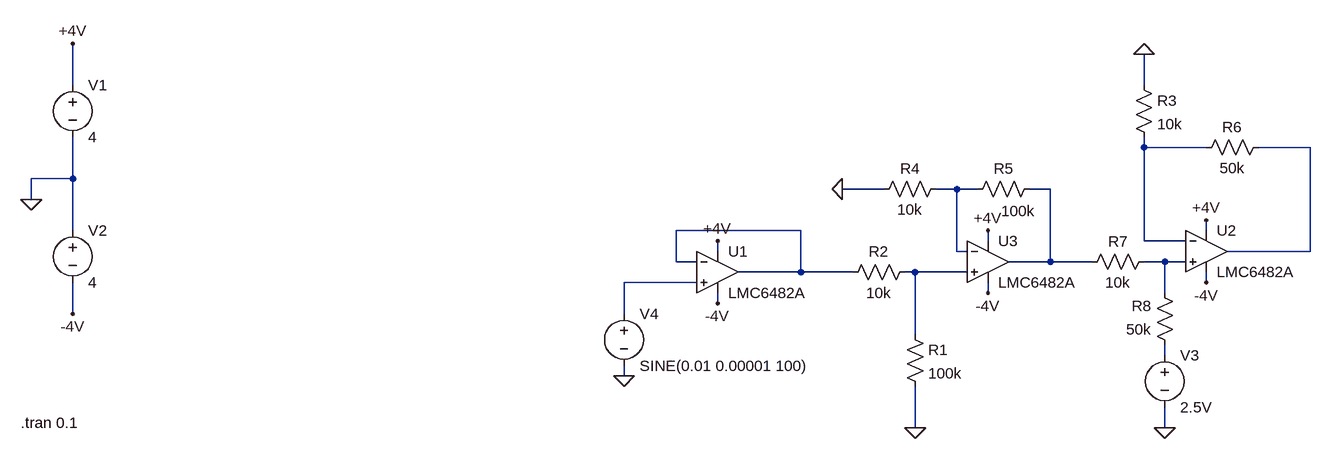
[diagram p0: schematic Lettore_fem.asc]
Lettore_fem.asc, the LTspice schematic file:
Version 4
SHEET 1 1044 680
WIRE -864 -64 -864 -128
WIRE 784 -64 784 -112
WIRE 784 32 784 16
WIRE 880 32 784 32
WIRE 1040 32 960 32
WIRE -864 80 -864 16
WIRE -864 80 -928 80
WIRE 384 96 320 96
WIRE 496 96 464 96
WIRE 528 96 496 96
WIRE 640 96 608 96
WIRE -928 112 -928 80
WIRE -864 160 -864 80
WIRE 256 160 64 160
WIRE 880 160 880 144
WIRE 544 176 544 160
WIRE 784 176 784 32
WIRE 848 176 784 176
WIRE 128 192 128 176
WIRE 496 192 496 96
WIRE 512 192 496 192
WIRE 1040 192 1040 32
WIRE 1040 192 912 192
WIRE 64 208 64 160
WIRE 96 208 64 208
WIRE 640 208 640 96
WIRE 640 208 576 208
WIRE 704 208 640 208
WIRE 816 208 784 208
WIRE 848 208 816 208
WIRE 256 224 256 160
WIRE 256 224 160 224
WIRE 336 224 256 224
WIRE 432 224 416 224
WIRE 512 224 432 224
WIRE 96 240 -16 240
WIRE 880 240 880 224
WIRE 544 256 544 240
WIRE 816 256 816 208
WIRE 128 272 128 256
WIRE -864 288 -864 240
WIRE -16 288 -16 240
WIRE 432 320 432 224
WIRE 816 352 816 336
WIRE -16 384 -16 368
WIRE 432 464 432 400
WIRE 816 464 816 432
FLAG -928 112 0
FLAG -864 -128 +4V
FLAG -864 288 -4V
FLAG 320 96 0
FLAG -16 384 0
FLAG 544 256 -4V
FLAG 544 160 +4V
FLAG 128 176 +4V
FLAG 128 272 -4V
FLAG 880 240 -4V
FLAG 880 144 +4V
FLAG 784 -112 0
FLAG 432 464 0
FLAG 816 464 0
SYMBOL ValVol\\TI\\LMC6482A 544 144 R0
SYMATTR InstName U3
SYMBOL voltage -864 -80 R0
SYMATTR InstName V1
SYMATTR Value 4
SYMBOL voltage -864 144 R0
SYMATTR InstName V2
SYMATTR Value 4
SYMBOL res 480 80 R90
WINDOW 0 0 56 VBottom 2
WINDOW 3 32 56 VTop 2
SYMATTR InstName R4
SYMATTR Value 10k
SYMBOL res 624 80 R90
WINDOW 0 0 56 VBottom 2
WINDOW 3 34 33 VTop 2
SYMATTR InstName R5
SYMATTR Value 100k
SYMBOL res 432 208 R90
WINDOW 0 0 56 VBottom 2
WINDOW 3 32 56 VTop 2
SYMATTR InstName R2
SYMATTR Value 10k
SYMBOL ValVol\\TI\\LMC6482A 128 160 R0
SYMATTR InstName U1
SYMBOL voltage -16 272 R0
WINDOW 123 0 0 Left 0
WINDOW 39 0 0 Left 0
SYMATTR InstName V4
SYMATTR Value SINE(0.01 0.00001 100)
SYMBOL ValVol\\TI\\LMC6482A 880 128 R0
SYMATTR InstName U2
SYMBOL res 976 16 R90
WINDOW 0 0 56 VBottom 2
WINDOW 3 32 56 VTop 2
SYMATTR InstName R6
SYMATTR Value 50k
SYMBOL res 768 -80 R0
SYMATTR InstName R3
SYMATTR Value 10k
SYMBOL res 416 304 R0
SYMATTR InstName R1
SYMATTR Value 100k
SYMBOL res 800 192 R90
WINDOW 0 0 56 VBottom 2
WINDOW 3 32 56 VTop 2
SYMATTR InstName R7
SYMATTR Value 10k
SYMBOL res 832 352 R180
WINDOW 0 36 76 Left 2
WINDOW 3 36 40 Left 2
SYMATTR InstName R8
SYMATTR Value 50k
SYMBOL voltage 816 336 R0
SYMATTR InstName V3
SYMATTR Value 2.5V
TEXT -944 456 Left 2 !.tran 0.1

The netlist it stands for:
* Lettore_fem.asc
* U3: LMC6482A (symbol ValVol\TI\LMC6482A not available, pins judged from their places): In+=N007 In-=N003 V+=+4V V-=-4V OUT=N004
V1 +4V 0 4
V2 0 -4V 4
R4 N003 0 10k
R5 N004 N003 100k
R2 N007 N005 10k
* U1: LMC6482A (symbol ValVol\TI\LMC6482A not available, pins judged from their places): In+=N008 In-=N005 V+=+4V V-=-4V OUT=N005
V4 N008 0 SINE(0.01 0.00001 100)
* U2: LMC6482A (symbol ValVol\TI\LMC6482A not available, pins judged from their places): In+=N006 In-=N001 V+=+4V V-=-4V OUT=N002
R6 N002 N001 50k
R3 0 N001 10k
R1 N007 0 100k
R7 N006 N004 10k
R8 N009 N006 50k
V3 N009 0 2.5V
.tran 0.1
.backanno
.end